# EAGLE design MultiWiiShield2 (EAGLE 5.11)
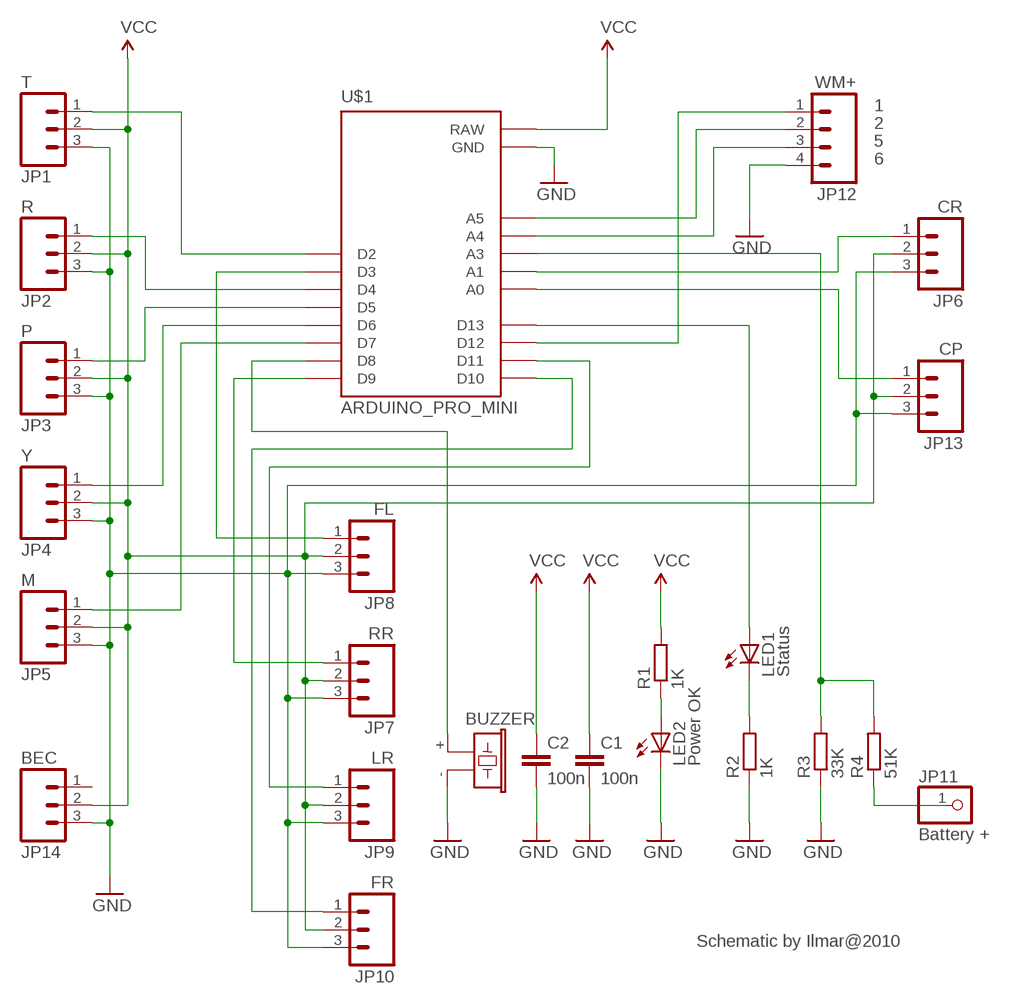
[diagram p0: schematic, sheet 1]

## Parts
BUZZER  F/CM12P  [F/CM12P]
C1  100n  CAPPTH  [CAP-PTH-SMALL]
C2  100n  CAPPTH  [CAP-PTH-SMALL]
JP1  T  M03PTH  [1X03]
JP2  R  M03PTH  [1X03]
JP3  P  M03PTH  [1X03]
JP4  Y  M03PTH  [1X03]
JP5  M  M03PTH  [1X03]
JP6  CR  M03PTH  [1X03]
JP7  RR  M03PTH  [1X03]
JP8  FL  M03PTH  [1X03]
JP9  LR  M03PTH  [1X03]
JP10  FR  M03PTH  [1X03]
JP11  Battery +  PINHD-1X1  [1X01]
JP12  WM+  M04PTH  [1X04]
JP13  CP  M03PTH  [1X03]
JP14  BEC  M03PTH  [1X03]
LED1  Status  LED5MM  [LED5MM]
LED2  Power OK  LED5MM  [LED5MM]
R1  1K  R-EU_0204/7  [0204/7]
R2  1K  R-EU_0204/7  [0204/7]
R3  33K  R-EU_0204/7  [0204/7]
R4  51K  R-EU_0204/7  [0204/7]
U$1  ARDUINO_PRO_MINI  [ARDUINO_PRO_MINI]

## Nets
GND: BUZZER.- C1.2 C2.2 JP1.3 JP2.3 JP3.3 JP4.3 JP5.3 JP6.3 JP7.3 JP8.3 JP9.3 JP10.3 JP12.4 JP13.3 JP14.3 LED2.K(C) R2.1 R3.1 U$1.GND1(GND)
N$1: LED1.K(C) R2.2
N$2: LED2.A R1.1
N$3: JP11.1 R4.1
N$4: R3.2 R4.2 U$1.A3
N$5: LED1.A U$1.D13
N$6: JP1.1 U$1.D2
N$7: JP2.1 U$1.D4
N$8: JP3.1 U$1.D5
N$9: JP4.1 U$1.D6
N$10: JP5.1 U$1.D7
N$11: JP8.1 U$1.D3
N$12: JP7.1 U$1.D9
N$13: BUZZER.+ U$1.D8
N$14: JP10.1 U$1.D10
N$15: JP6.1 U$1.A1
N$16: JP12.1 U$1.D12
N$17: JP12.2 U$1.A5
N$18: JP12.3 U$1.A4
N$19: JP13.1 U$1.A0
N$23: JP9.1 U$1.D11
VCC: C1.1 C2.1 JP1.2 JP2.2 JP3.2 JP4.2 JP5.2 JP6.2 JP7.2 JP8.2 JP9.2 JP10.2 JP13.2 JP14.2 R1.2 U$1.RAW
Unconnected: JP14.1

## Notes on the sheet
- 1
- 2
- 5
- 6
- Schematic by Ilmar@2010

## Library data of the parts
BUZZER = buzzer:F/CM12P: BUZZER Source: Buerklin
C1 C2 = SparkFun:CAP: Capacitor Standard 0603 ceramic capacitor, and 0.1" leaded capacitor.
JP1-JP10 JP13 JP14 = SparkFun:M03: Header 3 Standard 3-pin 0.1" header. Use with straight break away headers (SKU : PRT-00116), right angle break away headers (PRT-00553), swiss pins (PRT-00743), machine pins (PRT-00117), and female headers (PRT-00115). Molex polarized connector foot print use with SKU : PRT-08232 with associated crimp pins and housings.
JP11 = pinhead:PINHD-1X1: PIN HEADER
JP12 = SparkFun:M04: Header 4 Standard 4-pin 0.1" header. Use with straight break away headers (SKU : PRT-00116), right angle break away headers (PRT-00553), swiss pins (PRT-00743), machine pins (PRT-00117), and female headers (PRT-00115). Molex polarized connector foot print use with SKU : PRT-08231 with associated crimp pins and housings.
LED1 LED2 = SparkFun:LED: LEDs Standard schematic elements and footprints for 5mm, 3mm, 1206, and 0603 sized LEDs. 5mm - Spark Fun Electronics SKU : COM-00529 (and others)
R1-R4 = resistor:R-EU_: RESISTOR, European symbol
U$1 = MultiWiiArduino:ARDUINO_PRO_MINI: Arduino Pro Mini for MultiWii Trii or Quadcopter with NK ACC or Basic MultiWii Tri or Quadcopter

## Board
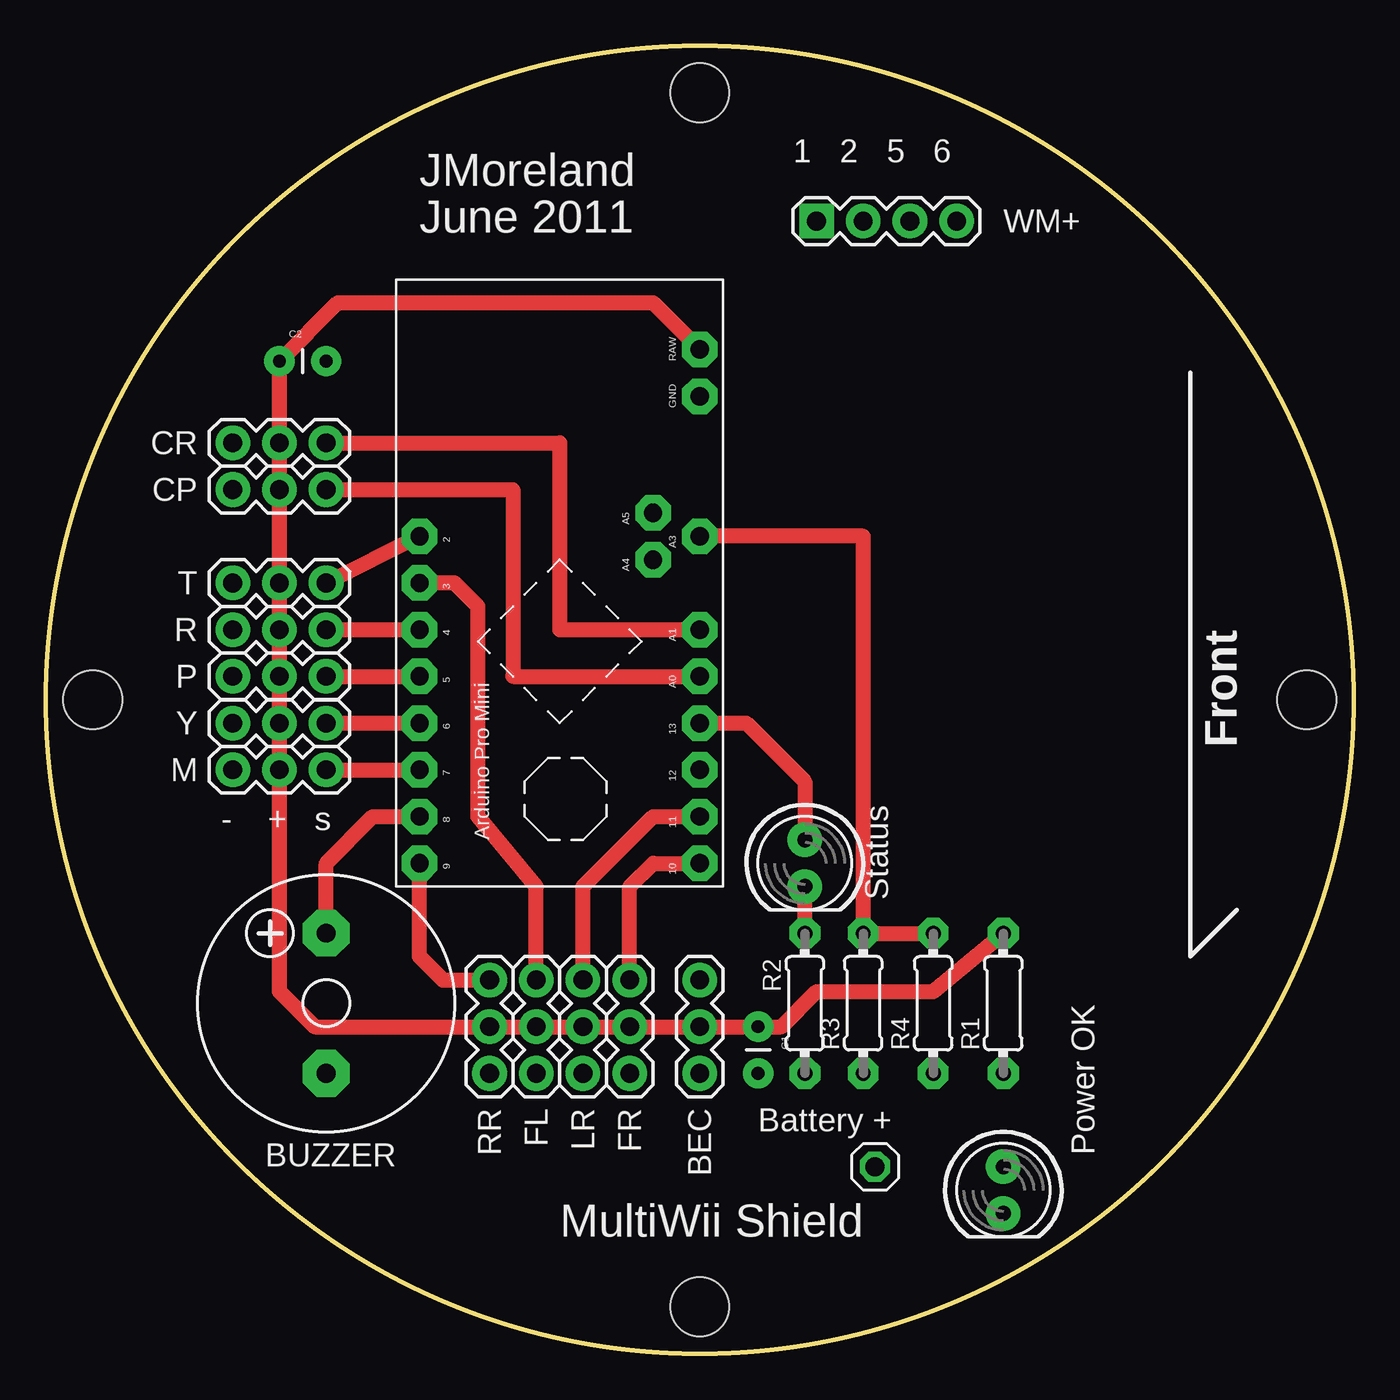
[diagram p1: board, top side]
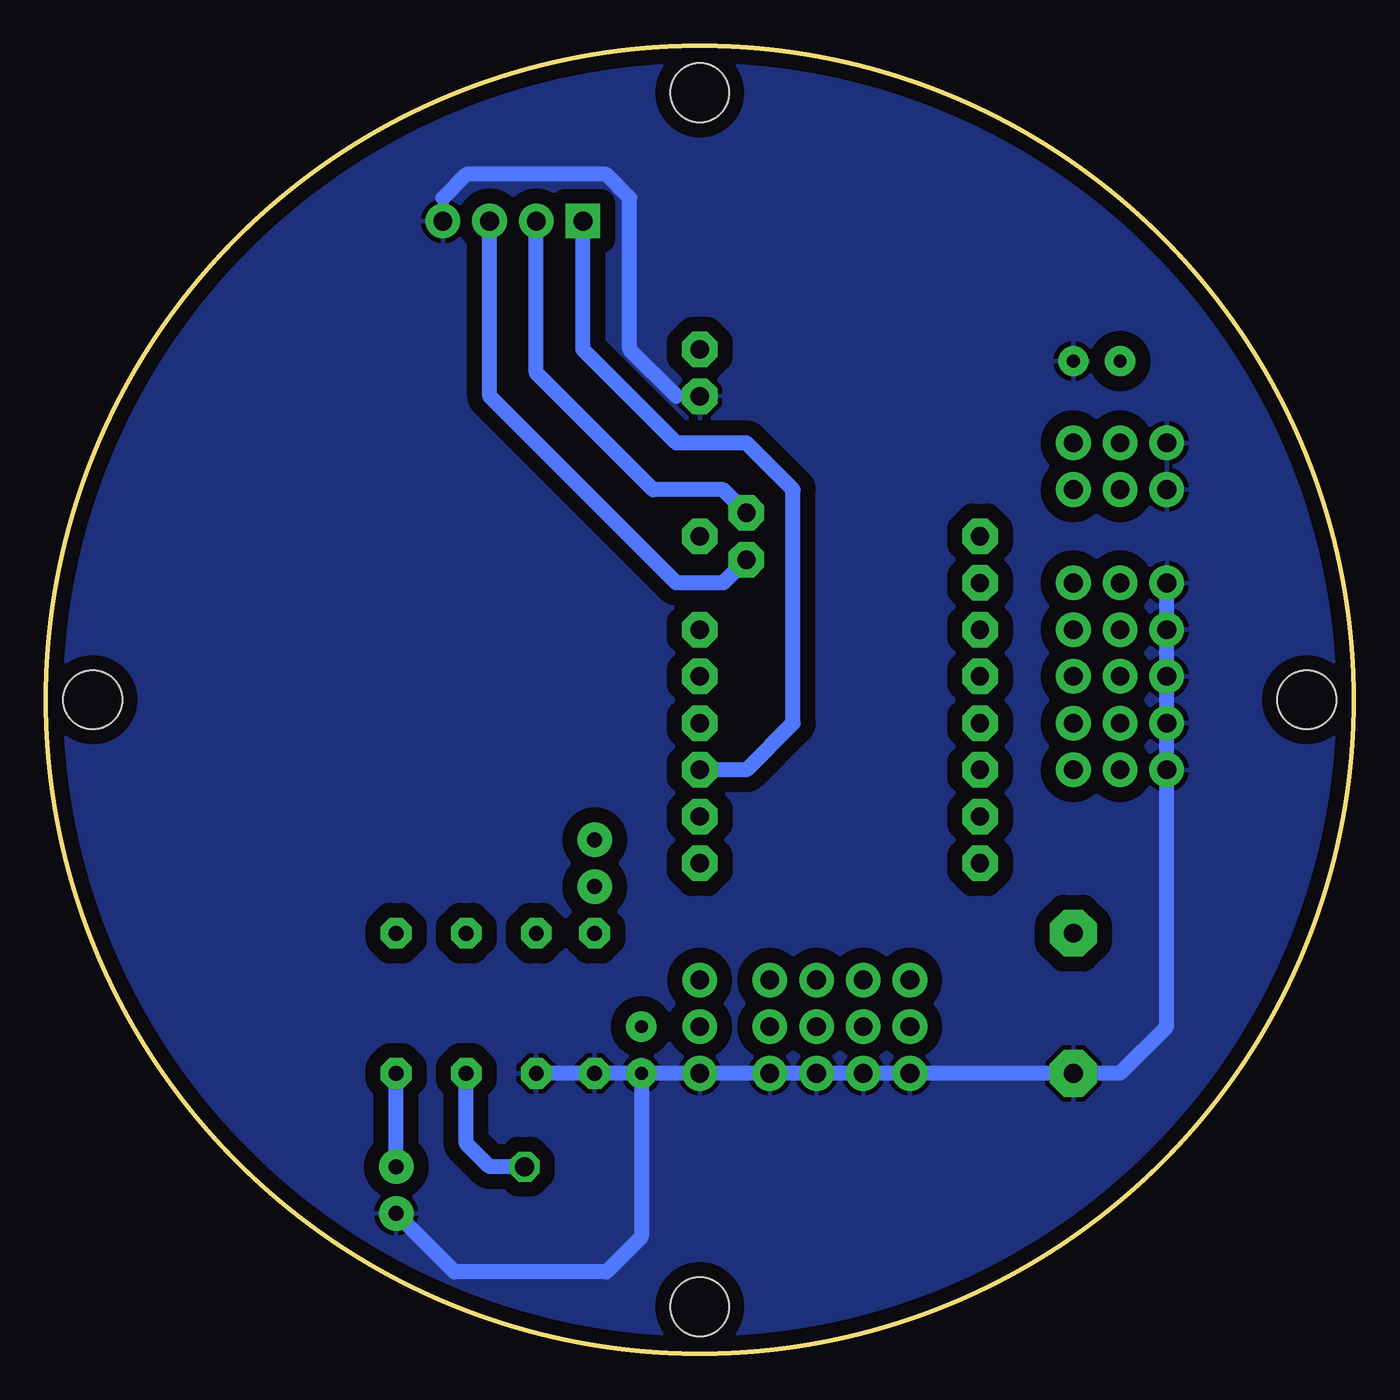
[diagram p2: board, bottom side, seen from below]

Size 71.12 x 71.12 mm. Coordinates in mm from the lower left corner, seen from the top.
Outline: circle at 35.56,35.56 radius 35.56
Copper layers (1*16): Top 0.035mm / dielectric 1.5mm / Bottom 0.035mm
Design rules "SparkFun": minimum track width 8mil, minimum drill 20mil, track to track 8mil, track to pad 8mil, pad to pad 8mil, via to via 8mil, smd to smd 8mil, copper to edge 10mil, drill to drill 8mil, minimum pad ring 12mil, minimum via ring 10mil, stop-mask expansion 4mil, vias tented up to drill 25mil, thermal gap 10mil
Holes 3.2 mm at 35.56,68.58 68.58,35.56 35.56,2.54 2.54,35.56

### Footprints (pad centres in the part's own frame; a part is rotated, then mirrored left to right if it is on the bottom)
F/CM12P = drill 1.016 pad 2.54 octagon: + 3.81,0; - -3.81,0
CAP-PTH-SMALL = drill 0.7 pad 1.651 round: 1 0,0; 2 2.54,0
1X03 = drill 1.016 pad 1.88 round: 1 0,0; 2 2.54,0; 3 5.08,0
1X01 = drill 1.016 octagon: 1 0,0
1X04 = drill 1.016 pad 1.88 square: 1 0,0 | drill 1.016 pad 1.88 round: 2 2.54,0; 3 5.08,0; 4 7.62,0
LED5MM = drill 0.813 pad 1.88 round: A -1.27,0; K 1.27,0
0204/7 = drill 0.813 pad 1.676 octagon: 1 -3.81,0; 2 3.81,0
ARDUINO_PRO_MINI = drill 1 pad 1.93 octagon: A0 -5.08,-7.62; A1 -2.54,-7.62; A3 2.54,-7.62; A4 1.27,-5.08; A5 3.81,-5.08; D2 2.54,7.62; D3 0,7.62; D4 -2.54,7.62; D5 -5.08,7.62; D6 -7.62,7.62; D7 -10.16,7.62; D8 -12.7,7.62; D9 -15.24,7.62; D10 -15.24,-7.62; D11 -12.7,-7.62; D12 -10.16,-7.62; D13 -7.62,-7.62; GND1 10.16,-7.62; RAW 12.7,-7.62

### Placement (x,y rotation side)
BUZZER  15.24,19.05 90 top
C1  38.74,17.78 270 top
C2  12.7,53.98 0 top
JP1  15.24,41.91 180 top
JP2  15.24,39.37 180 top
JP3  15.24,36.83 180 top
JP4  15.24,34.29 180 top
JP5  15.24,31.75 180 top
JP6  15.24,49.53 180 top
JP7  24.13,20.32 270 top
JP8  26.67,20.32 270 top
JP9  29.21,20.32 270 top
JP10  31.75,20.32 270 top
JP11  45.09,10.16 0 top
JP12  41.91,61.6 0 top
JP13  15.24,46.99 180 top
JP14  35.56,20.32 270 top
LED1  41.28,26.67 270 top
LED2  52.07,8.89 270 top
R1  52.07,19.05 90 top
R2  41.28,19.05 90 top
R3  44.45,19.05 90 top
R4  48.26,19.05 90 top
U$1  27.94,41.91 90 top

### Tracks (layer width: path | path; a pad name or v marks a point on that pad's centre or on a via)
GND
  Bottom 0.61: 49.53,62.87 JP12.4 | U$1.GND1 36.83,52.07
  Bottom 0.813: R3.1 R2.1 C1.2 | C1.2 JP14.3 JP10.3 JP9.3 JP8.3 JP7.3 BUZZER.- 12.7,15.24 10.16,17.78 JP5.3 JP4.3 JP3.3 JP2.3 JP1.3 | 36.83,52.07 39.37,54.61 39.37,62.87 40.64,64.14 48.26,64.14 49.53,62.87 | LED2.K 48.9,4.45 40.64,4.45 38.74,6.35 C1.2
  pour Bottom (isolate 0.813): -0.51,-0.51 75.69,-0.51 75.69,73.15 -0.51,73.15
N$1
  Top 0.813: R2.2 LED1.K
N$2
  Bottom 0.813: LED2.A R1.1
N$3
  Bottom 0.813: R4.1 48.26,11.43 46.99,10.16 JP11.1
N$4
  Top 0.813: R4.2 R3.2 44.45,44.45 U$1.A3
N$5
  Top 0.813: LED1.A 41.28,31.12 38.1,34.29 U$1.D13
N$6
  Top 0.813: JP1.1 U$1.D2
N$7
  Top 0.813: JP2.1 U$1.D4
N$8
  Top 0.813: JP3.1 U$1.D5
N$9
  Top 0.813: JP4.1 U$1.D6
N$10
  Top 0.813: JP5.1 U$1.D7
N$11
  Top 0.813: JP8.1 26.67,25.4 23.5,29.21 23.5,40.64 22.23,41.91 U$1.D3
N$12
  Top 0.813: JP7.1 21.59,20.32 20.32,21.59 U$1.D9
N$13
  Top 0.813: BUZZER.+ 15.24,26.67 17.78,29.21 U$1.D8
N$14
  Top 0.813: JP10.1 31.75,25.4 33.02,26.67 U$1.D10
N$15
  Top 0.813: JP6.1 27.94,49.53 27.94,39.37 U$1.A1
N$16
  Bottom 0.813: JP12.1 41.91,54.61 36.83,49.53 33.02,49.53 30.48,46.99 30.48,34.29 33.02,31.75 U$1.D12
N$17
  Bottom 0.813: JP12.2 44.45,53.34 38.1,46.99 34.29,46.99 U$1.A5
N$18
  Bottom 0.813: JP12.3 46.99,52.07 36.83,41.91 34.29,41.91 U$1.A4
N$19
  Top 0.813: U$1.A0 25.4,36.83 25.4,46.99 JP13.1
N$23
  Top 0.813: JP9.1 29.21,25.4 33.02,29.21 U$1.D11
VCC
  Top 0.813: R1.2 48.26,19.69 41.91,19.69 40.01,17.78 C1.1 JP14.2 JP10.2 JP9.2 JP8.2 JP7.2 14.61,17.78 12.7,19.69 JP5.2 JP4.2 JP3.2 JP2.2 JP1.2 JP13.2 JP6.2 C2.1 15.88,57.15 33.02,57.15 U$1.RAW

### Text on the board
tPlace: 1 | 2 | 5 | 6 | JMoreland | June 2011 | Front | - | + | s | MultiWii Shield
Document: Round MultiWiiCopter shield - adapter board by Ilmar
201bmp: /Users/jmoreland/Documents/test5.bmp